# Altium schematic sheet LED_Controller.SchDoc: UDP LED-Controller
size A4; DrawnBy: Jesper Falk
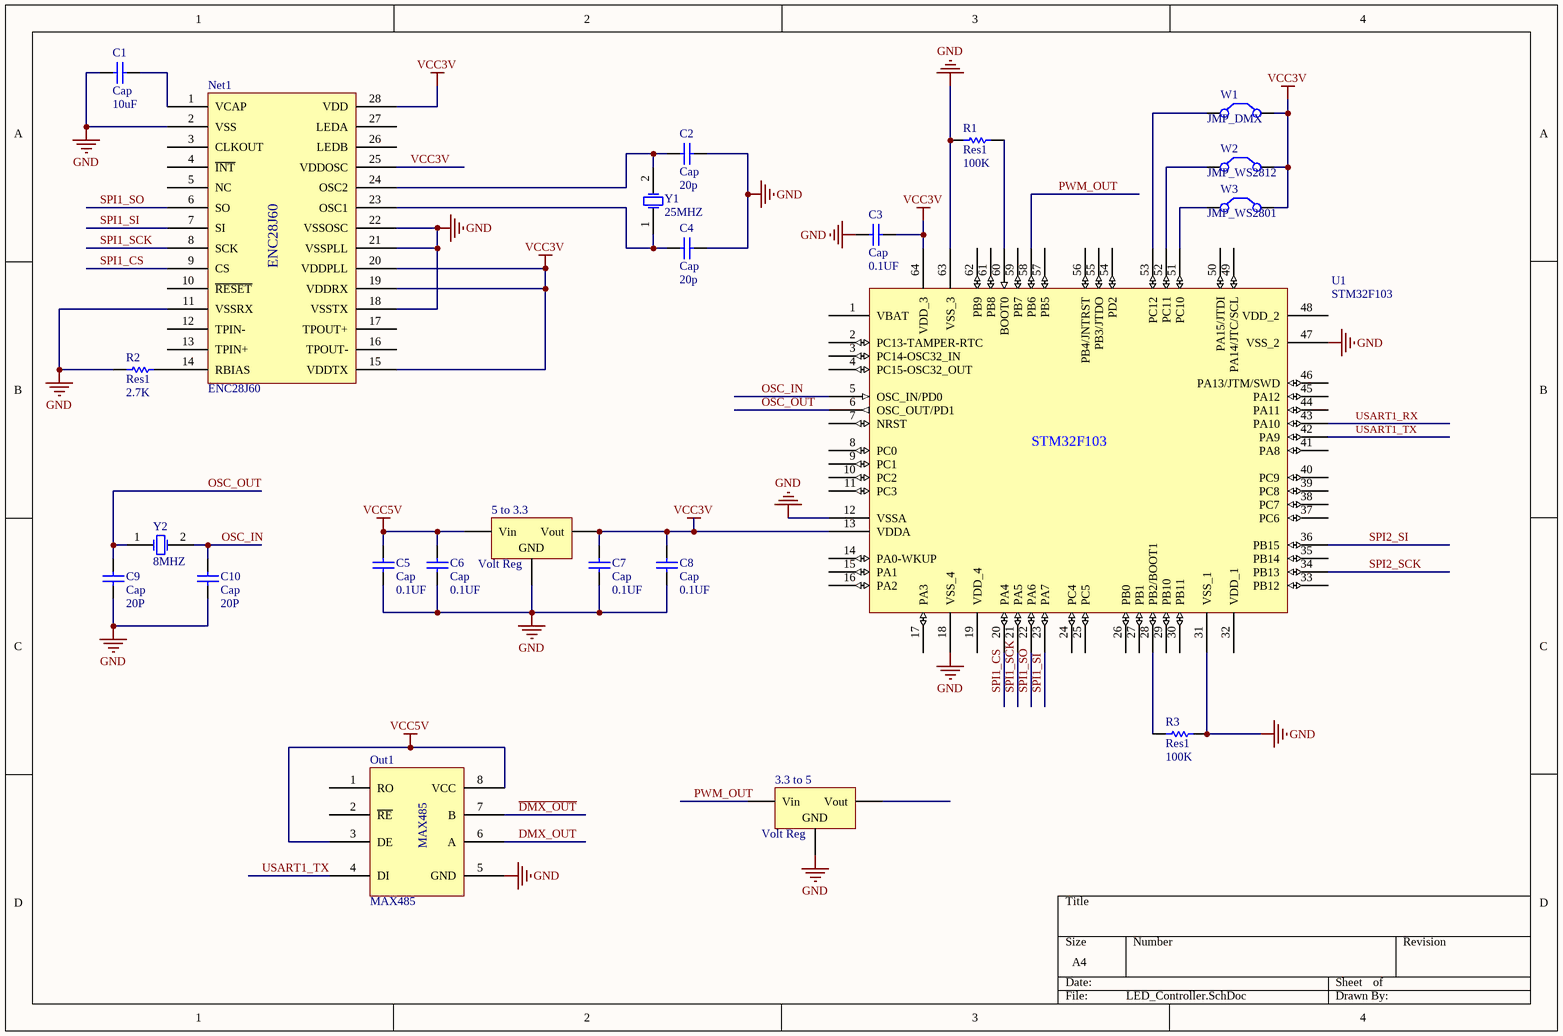
[diagram p0: LED_Controller.SchDoc]

## Parts
3.3_to_5  Volt Reg  [D2PAK_N]
5_to_3.3  Volt Reg  [D2PAK_N]
C1  Cap  value 10uF  [RAD-0.3]
C2  Cap  value 20p  [RAD-0.3]
C3  Cap  value 0.1UF  [RAD-0.3]
C4  Cap  value 20p  [RAD-0.3]
C5  Cap  value 0.1UF  [RAD-0.3]
C6  Cap  value 0.1UF  [RAD-0.3]
C7  Cap  value 0.1UF  [RAD-0.3]
C8  Cap  value 0.1UF  [RAD-0.3]
C9  Cap  value 20P  [RAD-0.3]
C10  Cap  value 20P  [RAD-0.3]
Net1  ENC28J60  [ENC28J60]
Out1  MAX485
R1  Res1  value 100K  [AXIAL-0.3]
R2  Res1  value 2.7K  [AXIAL-0.3]
R3  Res1  value 100K  [AXIAL-0.3]
U1  STM32F103  [LQFP64_L]
W1  JMP_DMX  [RAD-0.2]
W2  JMP_WS2812  [RAD-0.2]
W3  JMP_WS2801  [RAD-0.2]
Y1  25MHZ  [R38]
Y2  8MHZ  [R38]

## Nets
GND: 3.3_to_5.2(GND) 5_to_3.3.2(GND) C1.1 C2.2 C3.1 C4.2 C5.1 C6.1 C7.1 C8.1 C9.2 C10.2 Net1.2(VSS) Net1.11(VSSRX) Net1.18(VSSTX) Net1.21(VSSPLL) Net1.22(VSSOSC) Out1.5(GND) R1.1 R2.1 R3.2 U1.12(VSSA) U1.18(VSS_4) U1.31(VSS_1) U1.47(VSS_2) U1.63(VSS_3)
VCC3V: 5_to_3.3.3(Vout) C3.2 C7.2 C8.2 Net1.15(VDDTX) Net1.19(VDDRX) Net1.20(VDDPLL) Net1.25(VDDOSC) Net1.28(VDD) U1.13(VDDA) U1.64(VDD_3) W1.2(C2) W2.2(C2) W3.2(C2)
VCC5V: 5_to_3.3.1(Vin) C5.2 C6.2 Out1.3(DE) Out1.8(VCC)
~{DMX_OUT}: Out1.7(B)
DMX_OUT: Out1.6(A)
OSC_IN: C10.1 U1.5(OSC_IN/PD0) Y2.2(OSC2)
OSC_OUT: C9.1 U1.6(OSC_OUT/PD1) Y2.1(OSC1)
PWM_OUT: 3.3_to_5.1(Vin) U1.58(PB6)
SPI1_CS: Net1.9(CS) U1.20(PA4)
SPI1_SCK: Net1.8(SCK) U1.21(PA5)
SPI1_SI: Net1.7(SI) U1.23(PA7)
SPI1_SO: Net1.6(SO) U1.22(PA6)
SPI2_SCK: U1.34(PB13)
SPI2_SI: U1.36(PB15)
USART1_RX: U1.43(PA10)
USART1_TX: Out1.4(DI) U1.42(PA9)
NetC1_2: C1.2 Net1.1(VCAP)
NetC2_1: C2.1 Net1.24(OSC2) Y1.2(OSC2)
NetC4_1: C4.1 Net1.23(OSC1) Y1.1(OSC1)
NetNet1_14: Net1.14(RBIAS) R2.2
NetR1_2: R1.2 U1.60(BOOT0)
NetR3_1: R3.1 U1.28(PB2/BOOT1)
NetU1_51: U1.51(PC10) W3.1(C1)
NetU1_52: U1.52(PC11) W2.1(C1)
NetU1_53: U1.53(PC12) W1.1(C1)

Not connected (* = marked no-connect by the designer): 3.3_to_5 3(Vout); Net1 3(CLKOUT) 4(~{INT}) 5(NC) 10(~{RESET}) 12(TPIN-) 13(TPIN+) 16(TPOUT-) 17(TPOUT+) 26(LEDB) 27(LEDA); Out1 1(RO) 2(~{RE}); U1 1(VBAT) 2(PC13-TAMPER-RTC) 3(PC14-OSC32_IN) 4(PC15-OSC32_OUT) 7(NRST) 8(PC0) 9(PC1) 10(PC2) 11(PC3) 14(PA0-WKUP) 15(PA1) 16(PA2) 17(PA3) 19(VDD_4) 24(PC4) 25(PC5) 26(PB0) 27(PB1) 29(PB10) 30(PB11) 32(VDD_1) 33(PB12) 35(PB14) 37(PC6) 38(PC7) 39(PC8) 40(PC9) 41(PA8) 44(PA11) 45(PA12) 46(PA13/JTM/SWD) 48(VDD_2) 49(PA14/JTC/SCL) 50(PA15/JTDI) 54(PD2) 55(PB3/JTDO) 56(PB4/JNTRST) 57(PB5) 59(PB7) 61(PB8) 62(PB9)

## Library data of the parts
3.3_to_5 5_to_3.3 = Volt Reg: Voltage Regulator; Published: 24-Mar-1999; LatestRevisionDate: 29-May-2009; LatestRevisionNote: IPC-7351 Footprint Added.; PackageReference: D2PAK; Publisher: Altium Limited; PackageDescription: 3-Pin Transistor Outline Package 2.54 mm Pitch, 15.1 mm Lead Span
C1-C10 = Cap: Capacitor; Published: 8-Jun-2000; LatestRevisionDate: 17-Jul-2002; LatestRevisionNote: Re-released for DXP Platform.; PackageReference: RAD-0.3; Publisher: Altium Limited; PackageDescription: Radial Cap, Thru-Hole; 2 Leads; 0.3 in Pin Spacing
R1-R3 = Res1: Resistor; Published: 8-Jun-2000; LatestRevisionDate: 17-Jul-2002; LatestRevisionNote: Re-released for DXP Platform.; PackageReference: AXIAL-0.3; Publisher: Altium Limited; PackageDescription: Axial Device, Thru-Hole; 2 Leads; 0.3 in Pin Spacing
U1 = STM32F103R: STM32 ARM-based 32-bit MCU with xxx Kbytes Flash, 64-pin LQFP, Industrial Temperature; Published: 30-May-2008; DatasheetVersion: rev6, Mar-2008; PackageVersion: Mar-2008; PackageReference: LQFP64; Publisher: Altium Limited; PackageDescription: 64-Pin Low-Profile Quad Flat Pack, 10 x 10 mm Body, 0.5 mm Pitch (LQFP64); ComponentLink1Description: Manufacturer Link; ComponentLink1URL: www.st.com/stm32; ComponentLink2Description: Datasheet; ComponentLink2URL: http://www.st.com/stonline/products/literature/ds/13587.pdf
W1-W3 = Jumper: Jumper Wire; Published: 24-Mar-1999; LatestRevisionDate: 17-Jul-2002; LatestRevisionNote: Re-released for DXP Platform.; PackageReference: RAD-0.2; Publisher: Altium Limited; PackageDescription: Radial Cap, Thru-Hole; 2 Leads; 0.2 in Pin Spacing
Y1 Y2 = XTAL: Crystal Oscillator; Published: 8-Jun-2000; LatestRevisionDate: 17-Jul-2002; LatestRevisionNote: Re-released for DXP Platform.; PackageReference: R38; Publisher: Altium Limited; PackageDescription: Crystal, Thru-Hole; 2 Leads; Body 3.1 x 8.2 mm (Dia.xH)